# Altium schematic sheet VHDCI.SchDoc
size C; SheetNumber: 3; SheetTotal: 3
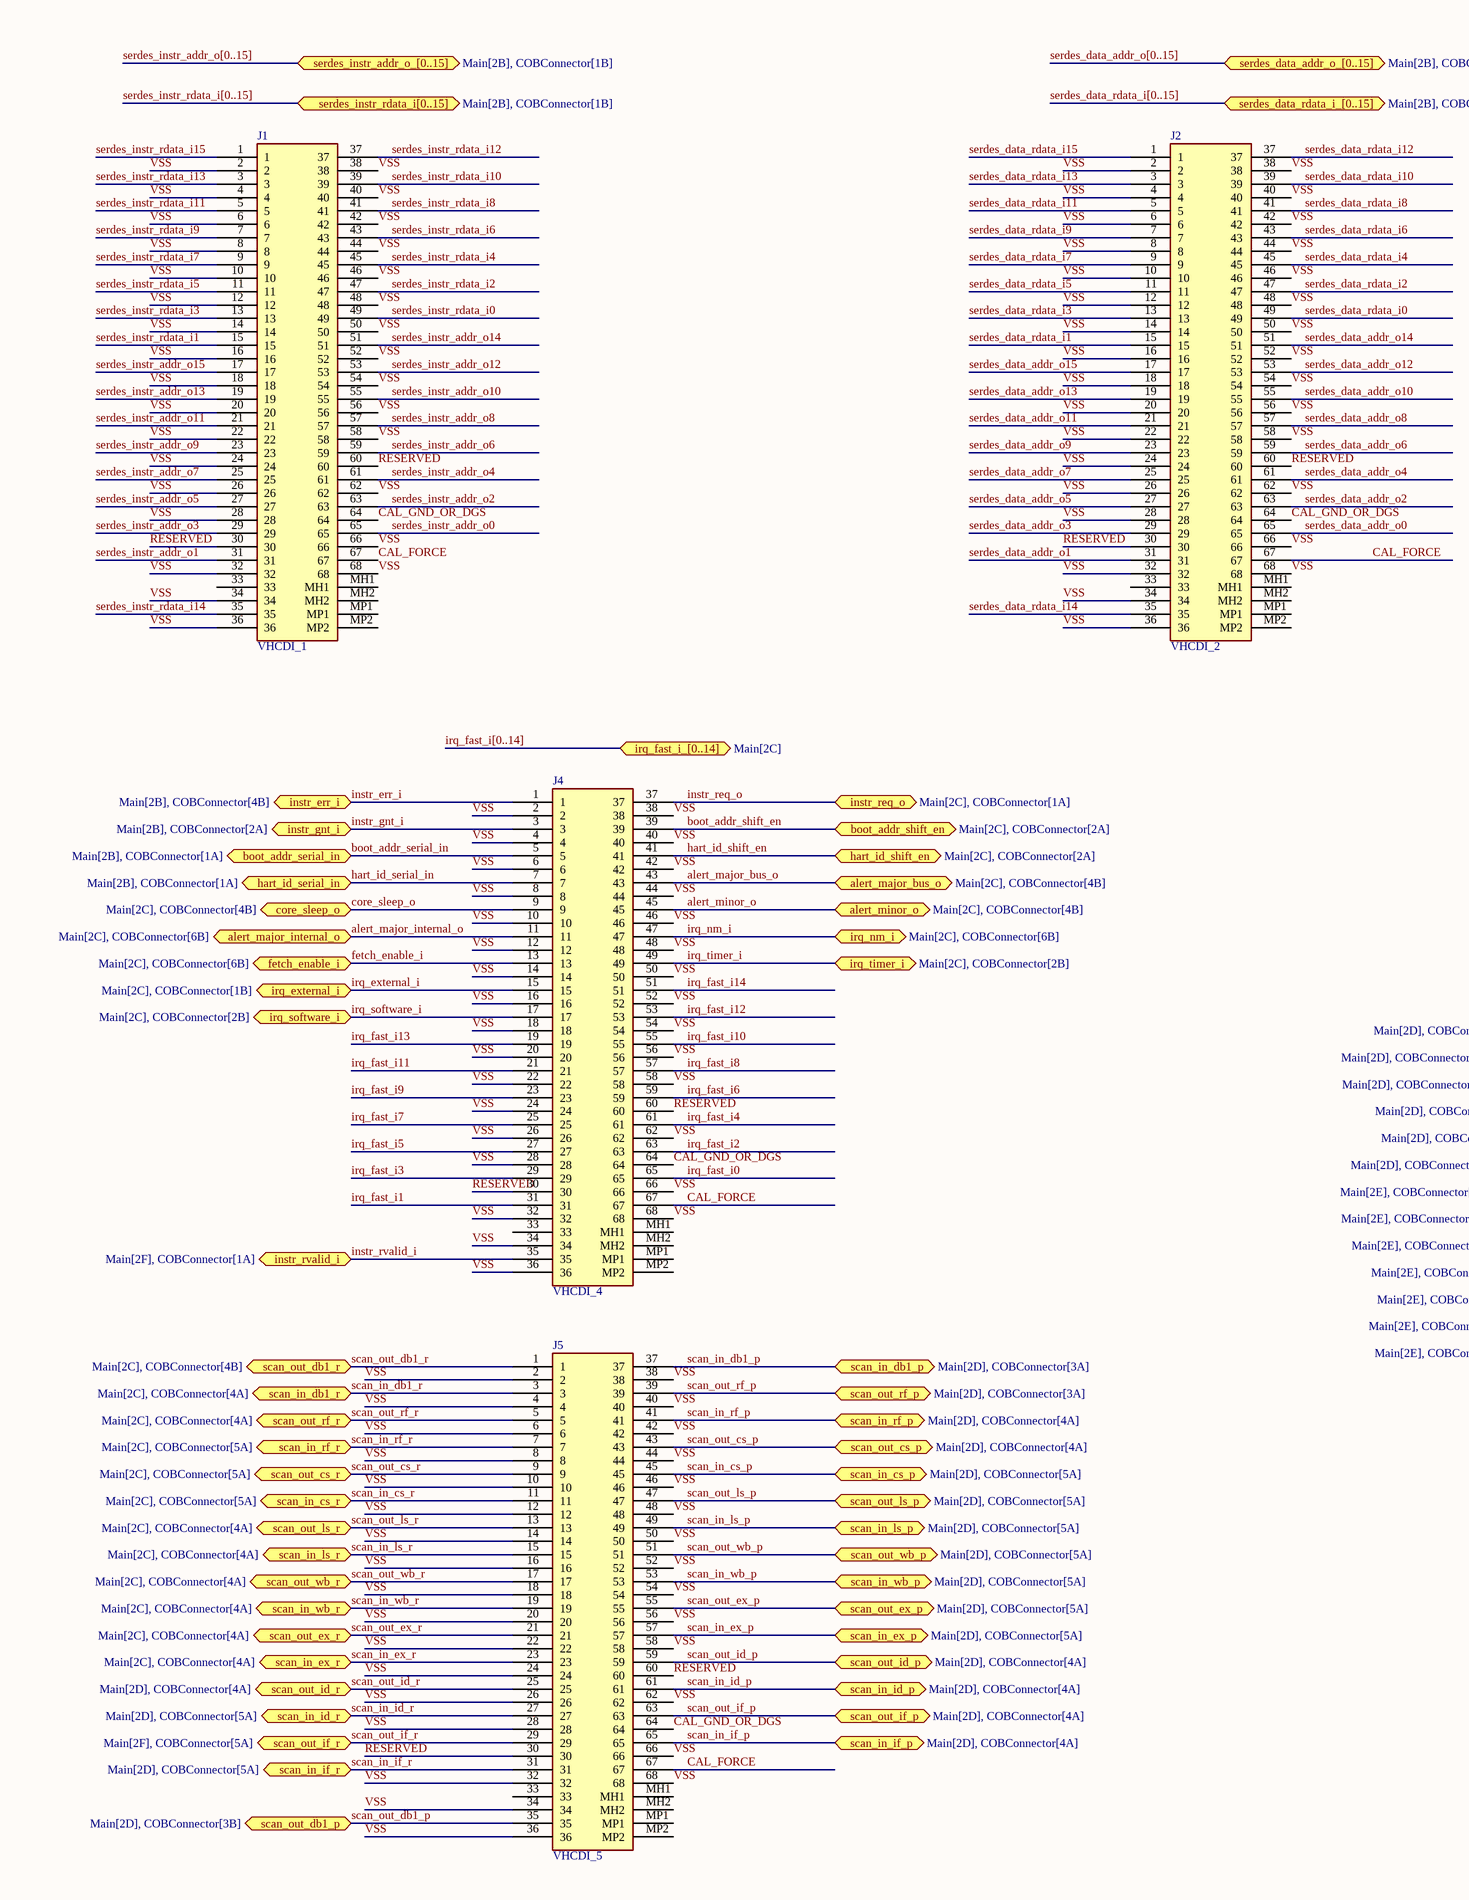
[diagram p0: VHDCI.SchDoc, left]
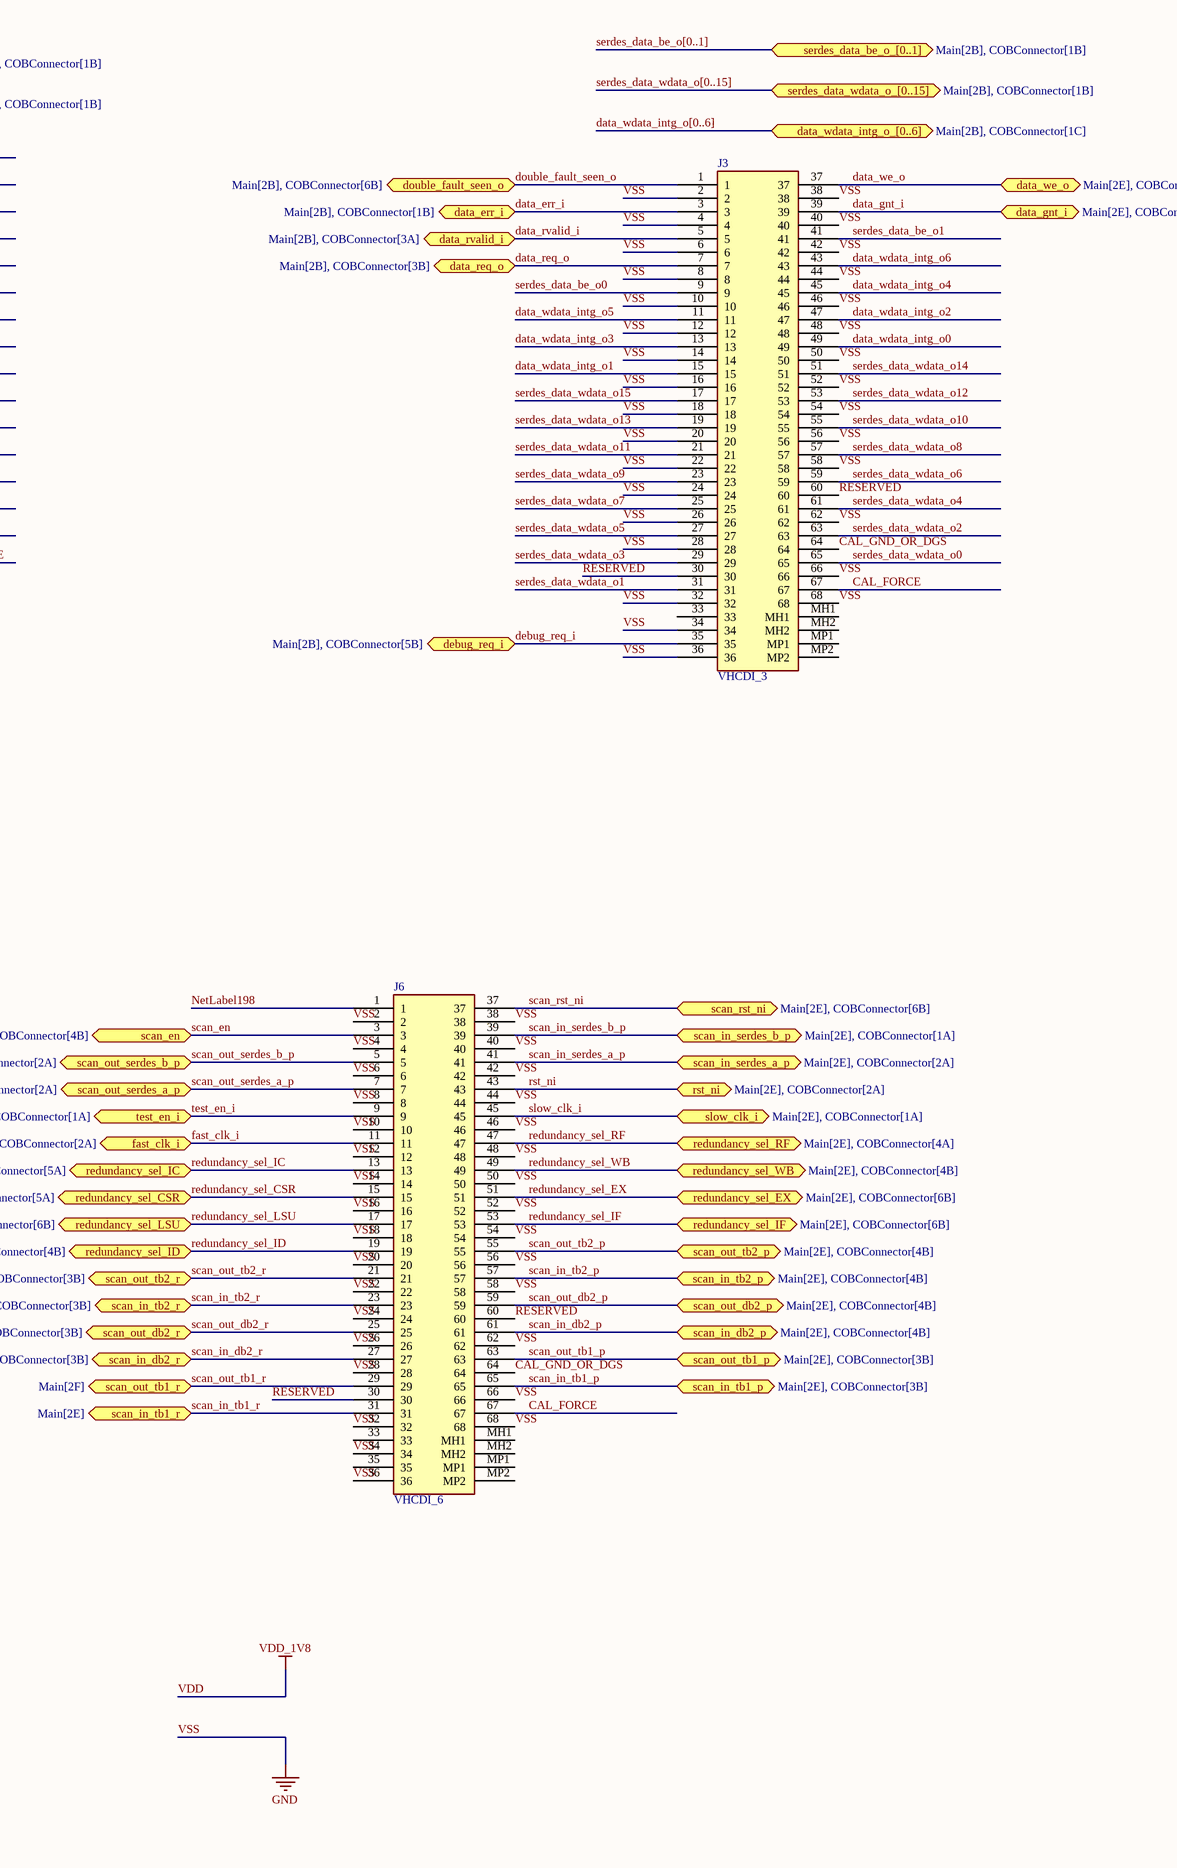
[diagram p1: VHDCI.SchDoc, right]

## Parts
J1  VHCDI_1  [CONN68_HDRA-EC_HON]
J2  VHCDI_2  [CONN68_HDRA-EC_HON]
J3  VHCDI_3  [CONN68_HDRA-EC_HON]
J4  VHCDI_4  [CONN68_HDRA-EC_HON]
J5  VHCDI_5  [CONN68_HDRA-EC_HON]
J6  VHCDI_6  [CONN68_HDRA-EC_HON]

## Ports
alert_major_bus_o (bidir, see Main[2C], COBConnector[4B]), alert_major_internal_o (bidir, see Main[2C], COBConnector[6B]), alert_minor_o (bidir, see Main[2C], COBConnector[4B]), boot_addr_serial_in (bidir, see Main[2B], COBConnector[1A]), boot_addr_shift_en (bidir, see Main[2C], COBConnector[2A]), core_sleep_o (bidir, see Main[2C], COBConnector[4B]), data_err_i (bidir, see Main[2B], COBConnector[1B]), data_gnt_i (bidir, see Main[2E], COBConnector[4A]), data_req_o (bidir, see Main[2B], COBConnector[3B]), data_rvalid_i (bidir, see Main[2B], COBConnector[3A]), data_wdata_intg_o_[0..6] (bidir, see Main[2B], COBConnector[1C]), data_we_o (bidir, see Main[2E], COBConnector[4A]), debug_req_i (bidir, see Main[2B], COBConnector[5B]), double_fault_seen_o (bidir, see Main[2B], COBConnector[6B]), fast_clk_i (bidir, see Main[2D], COBConnector[2A]), fetch_enable_i (bidir, see Main[2C], COBConnector[6B]), hart_id_serial_in (bidir, see Main[2B], COBConnector[1A]), hart_id_shift_en (bidir, see Main[2C], COBConnector[2A]), instr_err_i (bidir, see Main[2B], COBConnector[4B]), instr_gnt_i (bidir, see Main[2B], COBConnector[2A]), instr_req_o (bidir, see Main[2C], COBConnector[1A]), instr_rvalid_i (bidir, see Main[2F], COBConnector[1A]), irq_external_i (bidir, see Main[2C], COBConnector[1B]), irq_fast_i_[0..14] (bidir, see Main[2C]), irq_nm_i (bidir, see Main[2C], COBConnector[6B]), irq_software_i (bidir, see Main[2C], COBConnector[2B]), irq_timer_i (bidir, see Main[2C], COBConnector[2B]), redundancy_sel_CSR (bidir, see Main[2E], COBConnector[5A]), redundancy_sel_EX (bidir, see Main[2E], COBConnector[6B]), redundancy_sel_IC (bidir, see Main[2D], COBConnector[5A]), redundancy_sel_ID (bidir, see Main[2E], COBConnector[4B]), redundancy_sel_IF (bidir, see Main[2E], COBConnector[6B]), redundancy_sel_LSU (bidir, see Main[2E], COBConnector[6B]), redundancy_sel_RF (bidir, see Main[2E], COBConnector[4A]), redundancy_sel_WB (bidir, see Main[2E], COBConnector[4B]), rst_ni (bidir, see Main[2E], COBConnector[2A]), scan_en (bidir, see Main[2D], COBConnector[4B]), scan_in_cs_p (bidir, see Main[2D], COBConnector[5A]), scan_in_cs_r (bidir, see Main[2C], COBConnector[5A]), scan_in_db1_p (bidir, see Main[2D], COBConnector[3A]), scan_in_db1_r (bidir, see Main[2C], COBConnector[4A]), scan_in_db2_p (bidir, see Main[2E], COBConnector[4B]), scan_in_db2_r (bidir, see Main[2E], COBConnector[3B]), scan_in_ex_p (bidir, see Main[2D], COBConnector[5A]), scan_in_ex_r (bidir, see Main[2C], COBConnector[4A]), scan_in_id_p (bidir, see Main[2D], COBConnector[4A]), scan_in_id_r (bidir, see Main[2D], COBConnector[5A]), scan_in_if_p (bidir, see Main[2D], COBConnector[4A]), scan_in_if_r (bidir, see Main[2D], COBConnector[5A]), scan_in_ls_p (bidir, see Main[2D], COBConnector[5A]), scan_in_ls_r (bidir, see Main[2C], COBConnector[4A]), scan_in_rf_p (bidir, see Main[2D], COBConnector[4A]), scan_in_rf_r (bidir, see Main[2C], COBConnector[5A]), scan_in_serdes_a_p (bidir, see Main[2E], COBConnector[2A]), scan_in_serdes_b_p (bidir, see Main[2E], COBConnector[1A]), scan_in_tb1_p (bidir, see Main[2E], COBConnector[3B]), scan_in_tb1_r (bidir, see Main[2E]), scan_in_tb2_p (bidir, see Main[2E], COBConnector[4B]), scan_in_tb2_r (bidir, see Main[2E], COBConnector[3B]), scan_in_wb_p (bidir, see Main[2D], COBConnector[5A]), scan_in_wb_r (bidir, see Main[2C], COBConnector[4A]), scan_out_cs_p (bidir, see Main[2D], COBConnector[4A]), scan_out_cs_r (bidir, see Main[2C], COBConnector[5A]), scan_out_db1_p (bidir, see Main[2D], COBConnector[3B]), scan_out_db1_r (bidir, see Main[2C], COBConnector[4B]), scan_out_db2_p (bidir, see Main[2E], COBConnector[4B]), scan_out_db2_r (bidir, see Main[2E], COBConnector[3B]), scan_out_ex_p (bidir, see Main[2D], COBConnector[5A]), scan_out_ex_r (bidir, see Main[2C], COBConnector[4A]), scan_out_id_p (bidir, see Main[2D], COBConnector[4A]), scan_out_id_r (bidir, see Main[2D], COBConnector[4A]), scan_out_if_p (bidir, see Main[2D], COBConnector[4A]), scan_out_if_r (bidir, see Main[2F], COBConnector[5A]), scan_out_ls_p (bidir, see Main[2D], COBConnector[5A]), scan_out_ls_r (bidir, see Main[2C], COBConnector[4A]), scan_out_rf_p (bidir, see Main[2D], COBConnector[3A]), scan_out_rf_r (bidir, see Main[2C], COBConnector[4A]), scan_out_serdes_a_p (bidir, see Main[2D], COBConnector[2A]), scan_out_serdes_b_p (bidir, see Main[2D], COBConnector[2A]), scan_out_tb1_p (bidir, see Main[2E], COBConnector[3B]), scan_out_tb1_r (bidir, see Main[2F]), scan_out_tb2_p (bidir, see Main[2E], COBConnector[4B]), scan_out_tb2_r (bidir, see Main[2E], COBConnector[3B]), scan_out_wb_p (bidir, see Main[2D], COBConnector[5A]), scan_out_wb_r (bidir, see Main[2C], COBConnector[4A]), scan_rst_ni (bidir, see Main[2E], COBConnector[6B]), serdes_data_addr_o_[0..15] (bidir, see Main[2B], COBConnector[1B]), serdes_data_be_o_[0..1] (bidir, see Main[2B], COBConnector[1B]), serdes_data_rdata_i_[0..15] (bidir, see Main[2B], COBConnector[1B]), serdes_data_wdata_o_[0..15] (bidir, see Main[2B], COBConnector[1B]), serdes_instr_addr_o_[0..15] (bidir, see Main[2B], COBConnector[1B]), serdes_instr_rdata_i[0..15] (bidir, see Main[2B], COBConnector[1B]), slow_clk_i (bidir, see Main[2E], COBConnector[1A]), test_en_i (bidir, see Main[2D], COBConnector[1A])

## Nets
VSS: J1.2 J1.4 J1.6 J1.8 J1.10 J1.12 J1.14 J1.16 J1.18 J1.20 J1.22 J1.24 J1.26 J1.28 J1.32 J1.34 J1.36 J1.38 J1.40 J1.42 J1.44 J1.46 J1.48 J1.50 J1.52 J1.54 J1.56 J1.58 J1.62 J1.66 J1.68 J2.2 J2.4 J2.6 J2.8 J2.10 J2.12 J2.14 J2.16 J2.18 J2.20 J2.22 J2.24 J2.26 J2.28 J2.32 J2.34 J2.36 J2.38 J2.40 J2.42 J2.44 J2.46 J2.48 J2.50 J2.52 J2.54 J2.56 J2.58 J2.62 J2.66 J2.68 J3.2 J3.4 J3.6 J3.8 J3.10 J3.12 J3.14 J3.16 J3.18 J3.20 J3.22 J3.24 J3.26 J3.28 J3.32 J3.34 J3.36 J3.38 J3.40 J3.42 J3.44 J3.46 J3.48 J3.50 J3.52 J3.54 J3.56 J3.58 J3.62 J3.66 J3.68 J4.2 J4.4 J4.6 J4.8 J4.10 J4.12 J4.14 J4.16 J4.18 J4.20 J4.22 J4.24 J4.26 J4.28 J4.32 J4.34 J4.36 J4.38 J4.40 J4.42 J4.44 J4.46 J4.48 J4.50 J4.52 J4.54 J4.56 J4.58 J4.62 J4.66 J4.68 J5.2 J5.4 J5.6 J5.8 J5.10 J5.12 J5.14 J5.16 J5.18 J5.20 J5.22 J5.24 J5.26 J5.28 J5.32 J5.34 J5.36 J5.38 J5.40 J5.42 J5.44 J5.46 J5.48 J5.50 J5.52 J5.54 J5.56 J5.58 J5.62 J5.66 J5.68 J6.2 J6.4 J6.6 J6.8 J6.10 J6.12 J6.14 J6.16 J6.18 J6.20 J6.22 J6.24 J6.26 J6.28 J6.32 J6.34 J6.36 J6.38 J6.40 J6.42 J6.44 J6.46 J6.48 J6.50 J6.52 J6.54 J6.56 J6.58 J6.62 J6.66 J6.68  [also labelled GND]
alert_major_bus_o: J4.43 ; port alert_major_bus_o
alert_major_internal_o: J4.11 ; port alert_major_internal_o
alert_minor_o: J4.45 ; port alert_minor_o
boot_addr_serial_in: J4.5 ; port boot_addr_serial_in
boot_addr_shift_en: J4.39 ; port boot_addr_shift_en
CAL_FORCE: J1.67 J2.67 J3.67 J4.67 J5.67 J6.67
CAL_GND_OR_DGS: J1.64 J2.64 J3.64 J4.64 J5.64 J6.64
core_sleep_o: J4.9 ; port core_sleep_o
data_err_i: J3.3 ; port data_err_i
data_gnt_i: J3.39 ; port data_gnt_i
data_req_o: J3.7 ; port data_req_o
data_rvalid_i: J3.5 ; port data_rvalid_i
data_wdata_intg_o0: J3.49
data_wdata_intg_o1: J3.15
data_wdata_intg_o2: J3.47
data_wdata_intg_o3: J3.13
data_wdata_intg_o4: J3.45
data_wdata_intg_o5: J3.11
data_wdata_intg_o6: J3.43
data_we_o: J3.37 ; port data_we_o
debug_req_i: J3.35 ; port debug_req_i
double_fault_seen_o: J3.1 ; port double_fault_seen_o
fast_clk_i: J6.11 ; port fast_clk_i
fetch_enable_i: J4.13 ; port fetch_enable_i
hart_id_serial_in: J4.7 ; port hart_id_serial_in
hart_id_shift_en: J4.41 ; port hart_id_shift_en
instr_err_i: J4.1 ; port instr_err_i
instr_gnt_i: J4.3 ; port instr_gnt_i
instr_req_o: J4.37 ; port instr_req_o
instr_rvalid_i: J4.35 ; port instr_rvalid_i
irq_external_i: J4.15 ; port irq_external_i
irq_fast_i0: J4.65
irq_fast_i1: J4.31
irq_fast_i2: J4.63
irq_fast_i3: J4.29
irq_fast_i4: J4.61
irq_fast_i5: J4.27
irq_fast_i6: J4.59
irq_fast_i7: J4.25
irq_fast_i8: J4.57
irq_fast_i9: J4.23
irq_fast_i10: J4.55
irq_fast_i11: J4.21
irq_fast_i12: J4.53
irq_fast_i13: J4.19
irq_fast_i14: J4.51
irq_nm_i: J4.47 ; port irq_nm_i
irq_software_i: J4.17 ; port irq_software_i
irq_timer_i: J4.49 ; port irq_timer_i
NetLabel198: J6.1
redundancy_sel_CSR: J6.15 ; port redundancy_sel_CSR
redundancy_sel_EX: J6.51 ; port redundancy_sel_EX
redundancy_sel_IC: J6.13 ; port redundancy_sel_IC
redundancy_sel_ID: J6.19 ; port redundancy_sel_ID
redundancy_sel_IF: J6.53 ; port redundancy_sel_IF
redundancy_sel_LSU: J6.17 ; port redundancy_sel_LSU
redundancy_sel_RF: J6.47 ; port redundancy_sel_RF
redundancy_sel_WB: J6.49 ; port redundancy_sel_WB
RESERVED: J1.30 J1.60 J2.30 J2.60 J3.30 J3.60 J4.30 J4.60 J5.30 J5.60 J6.30 J6.60
rst_ni: J6.43 ; port rst_ni
scan_en: J6.3 ; port scan_en
scan_in_cs_p: J5.45 ; port scan_in_cs_p
scan_in_cs_r: J5.11 ; port scan_in_cs_r
scan_in_db1_p: J5.37 ; port scan_in_db1_p
scan_in_db1_r: J5.3 ; port scan_in_db1_r
scan_in_db2_p: J6.61 ; port scan_in_db2_p
scan_in_db2_r: J6.27 ; port scan_in_db2_r
scan_in_ex_p: J5.57 ; port scan_in_ex_p
scan_in_ex_r: J5.23 ; port scan_in_ex_r
scan_in_id_p: J5.61 ; port scan_in_id_p
scan_in_id_r: J5.27 ; port scan_in_id_r
scan_in_if_p: J5.65 ; port scan_in_if_p
scan_in_if_r: J5.31 ; port scan_in_if_r
scan_in_ls_p: J5.49 ; port scan_in_ls_p
scan_in_ls_r: J5.15 ; port scan_in_ls_r
scan_in_rf_p: J5.41 ; port scan_in_rf_p
scan_in_rf_r: J5.7 ; port scan_in_rf_r
scan_in_serdes_a_p: J6.41 ; port scan_in_serdes_a_p
scan_in_serdes_b_p: J6.39 ; port scan_in_serdes_b_p
scan_in_tb1_p: J6.65 ; port scan_in_tb1_p
scan_in_tb1_r: J6.31 ; port scan_in_tb1_r
scan_in_tb2_p: J6.57 ; port scan_in_tb2_p
scan_in_tb2_r: J6.23 ; port scan_in_tb2_r
scan_in_wb_p: J5.53 ; port scan_in_wb_p
scan_in_wb_r: J5.19 ; port scan_in_wb_r
scan_out_cs_p: J5.43 ; port scan_out_cs_p
scan_out_cs_r: J5.9 ; port scan_out_cs_r
scan_out_db1_p: J5.35 ; port scan_out_db1_p
scan_out_db1_r: J5.1 ; port scan_out_db1_r
scan_out_db2_p: J6.59 ; port scan_out_db2_p
scan_out_db2_r: J6.25 ; port scan_out_db2_r
scan_out_ex_p: J5.55 ; port scan_out_ex_p
scan_out_ex_r: J5.21 ; port scan_out_ex_r
scan_out_id_p: J5.59 ; port scan_out_id_p
scan_out_id_r: J5.25 ; port scan_out_id_r
scan_out_if_p: J5.63 ; port scan_out_if_p
scan_out_if_r: J5.29 ; port scan_out_if_r
scan_out_ls_p: J5.47 ; port scan_out_ls_p
scan_out_ls_r: J5.13 ; port scan_out_ls_r
scan_out_rf_p: J5.39 ; port scan_out_rf_p
scan_out_rf_r: J5.5 ; port scan_out_rf_r
scan_out_serdes_a_p: J6.7 ; port scan_out_serdes_a_p
scan_out_serdes_b_p: J6.5 ; port scan_out_serdes_b_p
scan_out_tb1_p: J6.63 ; port scan_out_tb1_p
scan_out_tb1_r: J6.29 ; port scan_out_tb1_r
scan_out_tb2_p: J6.55 ; port scan_out_tb2_p
scan_out_tb2_r: J6.21 ; port scan_out_tb2_r
scan_out_wb_p: J5.51 ; port scan_out_wb_p
scan_out_wb_r: J5.17 ; port scan_out_wb_r
scan_rst_ni: J6.37 ; port scan_rst_ni
serdes_data_addr_o0: J2.65
serdes_data_addr_o1: J2.31
serdes_data_addr_o2: J2.63
serdes_data_addr_o3: J2.29
serdes_data_addr_o4: J2.61
serdes_data_addr_o5: J2.27
serdes_data_addr_o6: J2.59
serdes_data_addr_o7: J2.25
serdes_data_addr_o8: J2.57
serdes_data_addr_o9: J2.23
serdes_data_addr_o10: J2.55
serdes_data_addr_o11: J2.21
serdes_data_addr_o12: J2.53
serdes_data_addr_o13: J2.19
serdes_data_addr_o14: J2.51
serdes_data_addr_o15: J2.17
serdes_data_be_o0: J3.9
serdes_data_be_o1: J3.41
serdes_data_rdata_i0: J2.49
serdes_data_rdata_i1: J2.15
serdes_data_rdata_i2: J2.47
serdes_data_rdata_i3: J2.13
serdes_data_rdata_i4: J2.45
serdes_data_rdata_i5: J2.11
serdes_data_rdata_i6: J2.43
serdes_data_rdata_i7: J2.9
serdes_data_rdata_i8: J2.41
serdes_data_rdata_i9: J2.7
serdes_data_rdata_i10: J2.39
serdes_data_rdata_i11: J2.5
serdes_data_rdata_i12: J2.37
serdes_data_rdata_i13: J2.3
serdes_data_rdata_i14: J2.35
serdes_data_rdata_i15: J2.1
serdes_data_wdata_o0: J3.65
serdes_data_wdata_o1: J3.31
serdes_data_wdata_o2: J3.63
serdes_data_wdata_o3: J3.29
serdes_data_wdata_o4: J3.61
serdes_data_wdata_o5: J3.27
serdes_data_wdata_o6: J3.59
serdes_data_wdata_o7: J3.25
serdes_data_wdata_o8: J3.57
serdes_data_wdata_o9: J3.23
serdes_data_wdata_o10: J3.55
serdes_data_wdata_o11: J3.21
serdes_data_wdata_o12: J3.53
serdes_data_wdata_o13: J3.19
serdes_data_wdata_o14: J3.51
serdes_data_wdata_o15: J3.17
serdes_instr_addr_o0: J1.65
serdes_instr_addr_o1: J1.31
serdes_instr_addr_o2: J1.63
serdes_instr_addr_o3: J1.29
serdes_instr_addr_o4: J1.61
serdes_instr_addr_o5: J1.27
serdes_instr_addr_o6: J1.59
serdes_instr_addr_o7: J1.25
serdes_instr_addr_o8: J1.57
serdes_instr_addr_o9: J1.23
serdes_instr_addr_o10: J1.55
serdes_instr_addr_o11: J1.21
serdes_instr_addr_o12: J1.53
serdes_instr_addr_o13: J1.19
serdes_instr_addr_o14: J1.51
serdes_instr_addr_o15: J1.17
serdes_instr_rdata_i0: J1.49
serdes_instr_rdata_i1: J1.15
serdes_instr_rdata_i2: J1.47
serdes_instr_rdata_i3: J1.13
serdes_instr_rdata_i4: J1.45
serdes_instr_rdata_i5: J1.11
serdes_instr_rdata_i6: J1.43
serdes_instr_rdata_i7: J1.9
serdes_instr_rdata_i8: J1.41
serdes_instr_rdata_i9: J1.7
serdes_instr_rdata_i10: J1.39
serdes_instr_rdata_i11: J1.5
serdes_instr_rdata_i12: J1.37
serdes_instr_rdata_i13: J1.3
serdes_instr_rdata_i14: J1.35
serdes_instr_rdata_i15: J1.1
slow_clk_i: J6.45 ; port slow_clk_i
test_en_i: J6.9 ; port test_en_i

Not connected (* = marked no-connect by the designer): J1 33 MH1 MH2 MP1 MP2; J2 33 MH1 MH2 MP1 MP2; J3 33 MH1 MH2 MP1 MP2; J4 33 MH1 MH2 MP1 MP2; J5 33 MH1 MH2 MP1 MP2; J6 33 35 MH1 MH2 MP1 MP2

## Buses and harness runs
bus data_wdata_intg_o[0..6] = port data_wdata_intg_o_[0..6]
bus irq_fast_i[0..14] = port irq_fast_i_[0..14]
bus serdes_data_addr_o[0..15] = port serdes_data_addr_o_[0..15]
bus serdes_data_be_o[0..1] = port serdes_data_be_o_[0..1]
bus serdes_data_rdata_i[0..15] = port serdes_data_rdata_i_[0..15]
bus serdes_data_wdata_o[0..15] = port serdes_data_wdata_o_[0..15]
bus serdes_instr_addr_o[0..15] = port serdes_instr_addr_o_[0..15]
bus serdes_instr_rdata_i[0..15] = port serdes_instr_rdata_i[0..15]

## Library data of the parts
J1-J6 = 785633-01: Connector; Manufacturer_Name: NI; Datasheet Link: https://www.digikey.com/en/products/detail/ni/785633-01/16637125?s=N4IgTCBcDaIOwA4CsA2AzGkBdAvkA; Height: 10.8mm; Manufacturer_Part_Number: 785633-01